# Altium schematic sheet SD Card.SchDoc
size A4; SheetNumber: 2; SheetTotal: 11
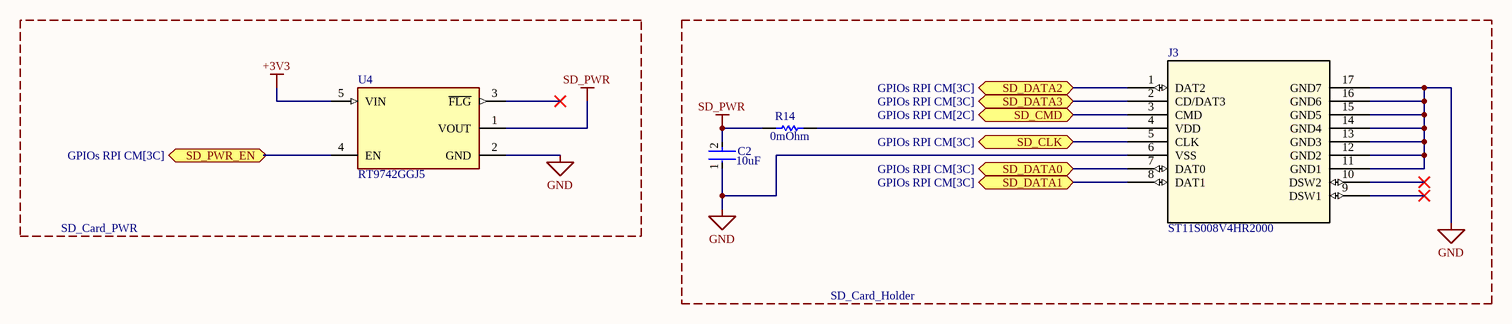
[diagram p0: SD Card.SchDoc]

## Parts
C2  Capacitance: 10uF  [FP-C1608-080-0_1-MFG]  (hidden comment: C1608X5R1A106K080AC)
J3  ST11S008V4HR2000  [ST11S008V4HR2000_JAE]
R14  Resistance: 0mOhm  [RESC1005X40X25LL05T05]  (hidden comment: ERJ2GE0R00X)
U4  RT9742GGJ5  [FP-RT9742GGJ5-IPC_C]

## Blocks framed on the sheet
SD_Card_PWR: U4
SD_Card_Holder: C2 J3 R14

## Ports
SD_CLK (bidir, see GPIOs RPI CM[3C]), SD_CMD (bidir, see GPIOs RPI CM[2C]), SD_DATA0 (bidir, see GPIOs RPI CM[3C]), SD_DATA1 (bidir, see GPIOs RPI CM[3C]), SD_DATA2 (bidir, see GPIOs RPI CM[3C]), SD_DATA3 (bidir, see GPIOs RPI CM[3C]), SD_PWR_EN (bidir, see GPIOs RPI CM[3C])

## Nets
+3V3: U4.5(VIN)
GND: C2.1 J3.6(VSS) J3.11(GND1) J3.12(GND2) J3.13(GND3) J3.14(GND4) J3.15(GND5) J3.16(GND6) J3.17(GND7) U4.2(GND)
SD_PWR: C2.2 R14.1 U4.1(VOUT)
SD_CLK: J3.5(CLK) ; port SD_CLK
SD_CMD: J3.3(CMD) ; port SD_CMD
SD_DATA0: J3.7(DAT0) ; port SD_DATA0
SD_DATA1: J3.8(DAT1) ; port SD_DATA1
SD_DATA2: J3.1(DAT2) ; port SD_DATA2
SD_DATA3: J3.2(CD/DAT3) ; port SD_DATA3
SD_PWR_EN: U4.4(EN) ; port SD_PWR_EN
NetJ3_4: J3.4(VDD) R14.2

Not connected (* = marked no-connect by the designer): J3 9(DSW1)* 10(DSW2)*; U4 3(~{FLG})*

## Library data of the parts
C2 = CMP-2000-04979-3: Multilayer Ceramic Capacitors 10μF ±10% 10V X5R SMD 0603; Dielectric Material: Ceramic; Construction: Flat; Height: 0.8mm; Thickness: 0.035inch; Case Code (Metric): 1608; Radiation Hardening: No; Number of Pins: 2; Voltage Rating (DC): 10V; Depth: 0.8mm; Voltage: 10V; RoHS Compliant: Yes; Voltage Rating: 10V; Package Quantity: 1; Resistor Type: Ceramic; Termination: SMD/SMT; Lead Free: Lead Free; REACH SVHC: No SVHC; Tolerance: 10%; Mount: Surface Mount; Series: C; Packaging: Tape and Reel; Width: 0.8mm; Dielectric: X5R; Weight: 7.1E-05oz; Length: 1.6mm; Max Operating Temperature: 85°C; Case Code (Imperial): 0603; Case/Package: 0603; Min Operating Temperature: -55°C
J3 = ST11S008V4HR2000: SD Card; Mfr_Name: JAE Electronics; RefDes: RefDes; Type: Type
R14 = CMP-2000-07451-1: Chip Resistor, 0 Ohm, 0.1 W, -55 to 155 degC, 0402 (1005 Metric), RoHS, Tape and Reel; Manufacturer: Panasonic; Voltage Rating (DC): 50V; Temperature Coefficient: 600ppm/��C; Max Power Dissipation: 100mW; Tolerance: 5%; Number of Terminations: 2; Mount: SurfaceMount; Height: 0.35mm; Packaging: TapeandReel; Contact Plating: Tin; Manufacturer URL: http://www.panasonic.com/; Composition: ThickFilm; Max Operating Temperature: 155degC; REACH SVHC: NoSVHC; Case/Package: 0402; Package Reference: 402; Depth: 0.5mm; Package Description: 2-Pin Surface Mount Device, Body 1 x 0.5 mm; Datasheet URL: https://industrial.panasonic.com/cdbs/www-data/pdf/RDA0000/AOA0000C301.pdf; RoHSCompliant: True; Case Code (Imperial): 0402; Military Standard: Not; Min Operating Temperature: -55degC; Power Rating: 100mW; Datasheet Version: 03/2015; Length: 1mm; Case Code (Metric): 1005; Termination: SMD/SMT; Mounting Technology: SurfaceMount; Voltage Rating: 50V; Width: 0.02inch; Package Quantity: 1; Lead Free: LeadFree; Radiation Hardening: No
U4 = CMP-79883-000001-1: IC PWR SWTCH N-CHAN 1:1 TSOT23-5; Interface: On/Off; Fault Protection: Over Temperature; Max Output Current: 1A; Number of Outputs: 1; Output Configuration: High Side; On-State Resistance: 70mR; REACH SVHC: No SVHC; Number of Pins: 23; Packaging: Tape and Reel; Case/Package: SOT-23-5; RoHS Compliant: Yes; Max Operating Temperature: 85°C; Min Operating Temperature: -40°C